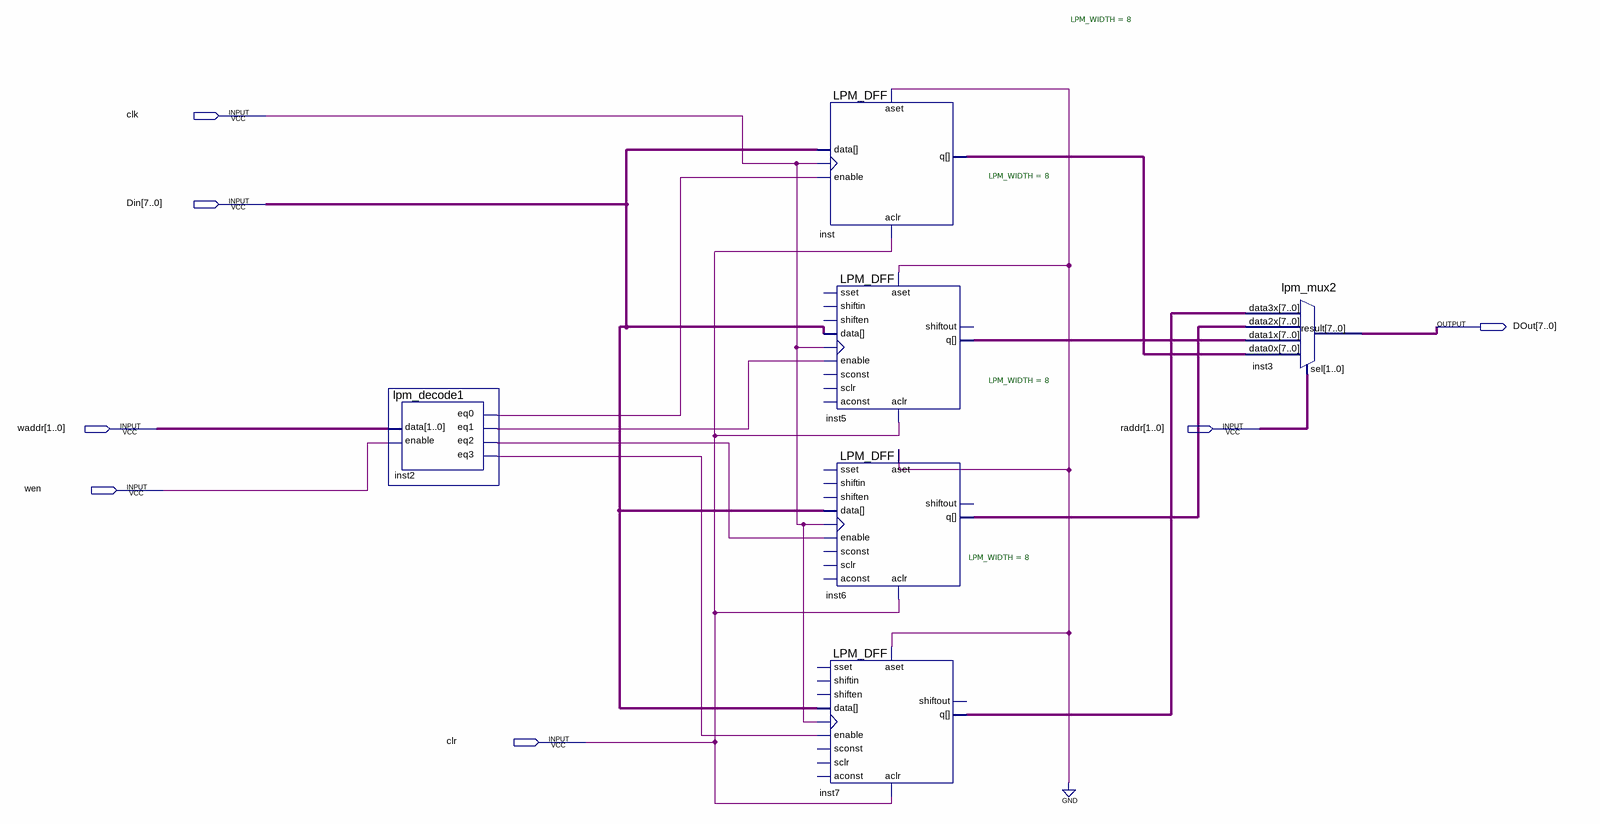
[diagram p0: schematic sheet]
// Quartus schematic registerblock.bdf as structural Verilog: 6 symbols, 7 pins
module registerblock (
  input  clk,
  input  [7:0] Din,
  input  [1:0] waddr,
  input  [1:0] raddr,
  input  wen,
  input  clr,
  output [7:0] DOut
);

  wire inst2_eq0, inst2_eq1, inst2_eq2, inst2_eq3;
  wire [7:0] inst5_q, inst6_q, inst7_q, inst_q;

  lpm_decode1 inst2 (.data(waddr), .enable(wen), .eq0(inst2_eq0), .eq1(inst2_eq1), .eq2(inst2_eq2), .eq3(inst2_eq3));
  LPM_DFF #(.LPM_WIDTH(8)) inst (.aclr(clr), .aset(1'b0), .clock(clk), .data(Din), .enable(inst2_eq0), .q(inst_q));
  LPM_DFF #(.LPM_WIDTH(8)) inst5 (
    .enable(inst2_eq1), .clock(clk), .data(Din), .aset(1'b0), .aclr(clr), .q(inst5_q));  // open: shiftin, shiften, aconst, sclr, sconst, sset, shiftout
  LPM_DFF #(.LPM_WIDTH(8)) inst6 (
    .enable(inst2_eq2), .clock(clk), .data(Din), .aset(1'b0), .aclr(clr), .q(inst6_q));  // open: shiftin, shiften, aconst, sclr, sconst, sset, shiftout
  LPM_DFF #(.LPM_WIDTH(8)) inst7 (
    .enable(inst2_eq3), .clock(clk), .data(Din), .aset(1'b0), .aclr(clr), .q(inst7_q));  // open: shiftin, shiften, aconst, sclr, sconst, sset, shiftout
  lpm_mux2 inst3 (.data3x(inst7_q), .data2x(inst6_q), .data1x(inst5_q), .data0x(inst_q), .sel(raddr), .result(DOut));
endmodule
